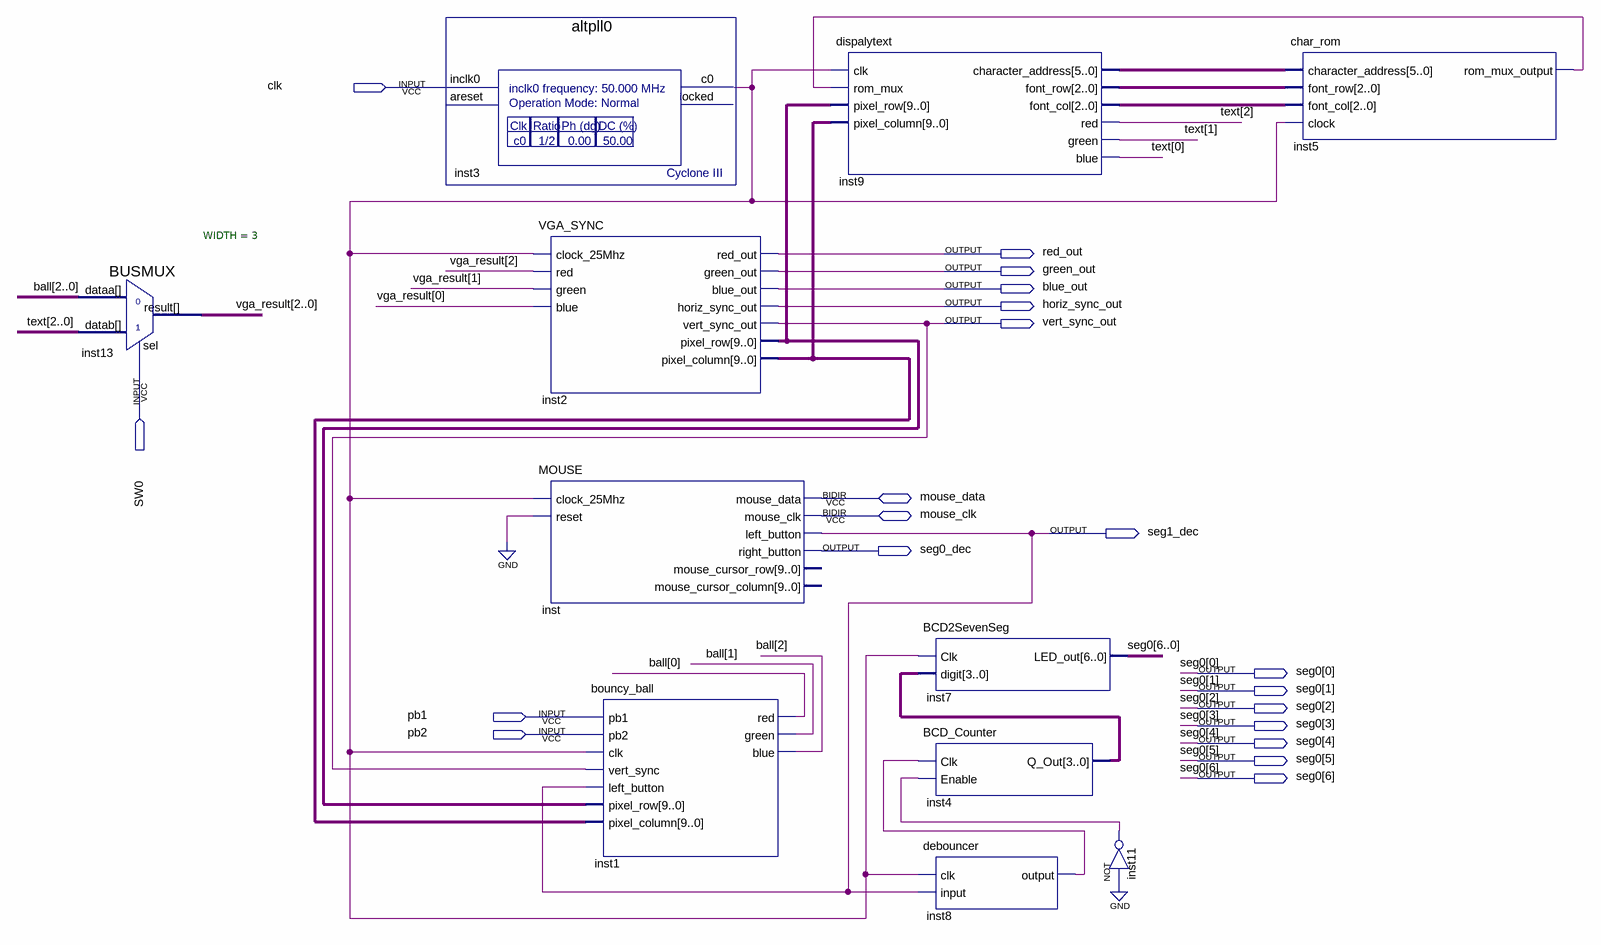
[diagram p0: schematic sheet]
// Quartus schematic CS305-Miniproject-Team-FloppyBird.bdf as structural Verilog: 11 symbols, 20 pins
module \CS305-Miniproject-Team-FloppyBird  (
  input  clk,
  input  SW0,
  input  pb1,
  input  pb2,
  inout  mouse_data,
  inout  mouse_clk,
  output red_out,
  output green_out,
  output blue_out,
  output horiz_sync_out,
  output vert_sync_out,
  output seg1_dec,
  output seg0_dec,
  output [6:0] seg0
);

  wire inst3_c0, inst5_rom_mux_output, inst8_output, inst11_out;
  wire [2:0] ball, inst9_font_col, inst9_font_row, text, vga_result;
  wire [3:0] inst4_q_out;
  wire [5:0] inst9_character_address;
  wire [9:0] inst2_pixel_column, inst2_pixel_row;

  BUSMUX #(.WIDTH(3)) inst13 (.datab(text), .sel(SW0), .dataa(ball), .result(vga_result));
  altpll0 inst3 (.inclk0(clk), .c0(inst3_c0));  // open: areset, locked
  VGA_SYNC inst2 (
    .clock_25Mhz(inst3_c0), .red(vga_result[2]), .green(vga_result[1]), .blue(vga_result[0]),
    .red_out(red_out), .green_out(green_out), .blue_out(blue_out), .horiz_sync_out(horiz_sync_out),
    .vert_sync_out(vert_sync_out), .pixel_row(inst2_pixel_row), .pixel_column(inst2_pixel_column));
  MOUSE inst (
    .clock_25Mhz(inst3_c0), .reset(1'b0), .left_button(seg1_dec), .right_button(seg0_dec),
    .mouse_data(mouse_data), .mouse_clk(mouse_clk));  // open: mouse_cursor_row, mouse_cursor_column
  bouncy_ball inst1 (
    .pb1(pb1), .pb2(pb2), .clk(inst3_c0), .vert_sync(vert_sync_out), .left_button(seg1_dec),
    .pixel_row(inst2_pixel_row), .pixel_column(inst2_pixel_column), .red(ball[0]), .green(ball[1]),
    .blue(ball[2]));
  dispalytext inst9 (
    .clk(inst3_c0), .rom_mux(inst5_rom_mux_output), .pixel_row(inst2_pixel_row),
    .pixel_column(inst2_pixel_column), .character_address(inst9_character_address),
    .font_row(inst9_font_row), .font_col(inst9_font_col), .red(text[2]), .green(text[1]), .blue(text[0]));
  BCD2SevenSeg inst7 (.Clk(inst3_c0), .digit(inst4_q_out), .LED_out(seg0));
  BCD_Counter inst4 (.Clk(inst8_output), .Enable(inst11_out), .Q_Out(inst4_q_out));
  debouncer inst8 (.clk(inst3_c0), .\input (seg1_dec), .\output (inst8_output));
  not inst11 (inst11_out, 1'b0);
  char_rom inst5 (
    .character_address(inst9_character_address), .font_row(inst9_font_row), .font_col(inst9_font_col),
    .clock(inst3_c0), .rom_mux_output(inst5_rom_mux_output));
endmodule
